# EAGLE design synapse_rpi3_adapter (EAGLE 7.6.0)
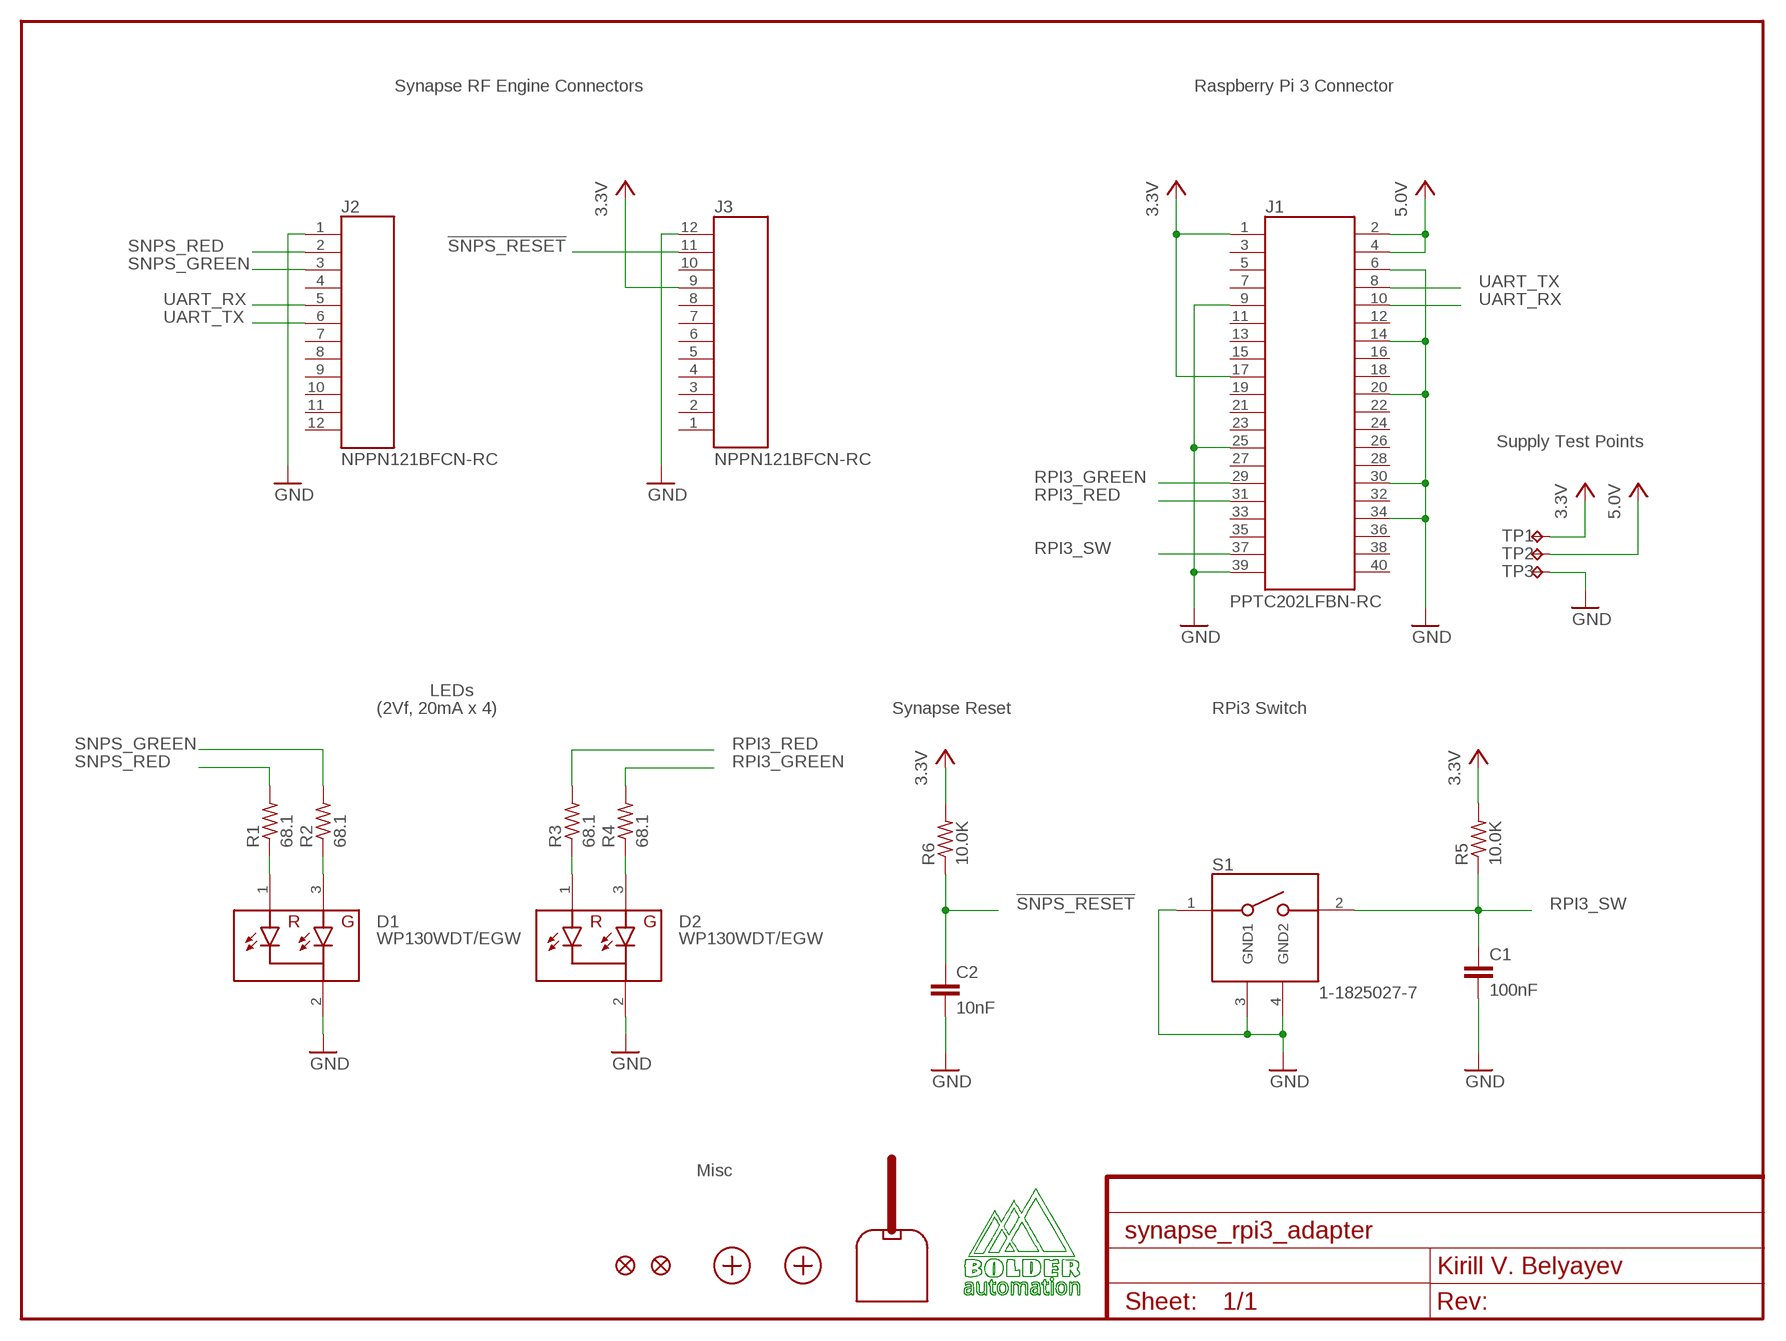
[diagram p0: schematic, sheet 1]
FRAME1 (FRAME-LETTER): CNAME: Synapse RPi3 Adapter; CREVISION: A; DESIGNER: Kirill V. Belyayev

## Parts
C1  100nF  C-EUC0603  [C0603]
C2  10nF  C-EUC0603  [C0603]
D1  WP130WDT/EGW  [WP130WDT/EGW]
D2  WP130WDT/EGW  [WP130WDT/EGW]
FD1  FIDUCIALUFIDUCIAL  [MICRO-FIDUCIAL]
FD2  FIDUCIALUFIDUCIAL  [MICRO-FIDUCIAL]
J1  PPTC202LFBN-RC  [PPTC202LFBN-RC]
J2  NPPN121BFCN-RC  [NPPN121BFCN-RC]
J3  NPPN121BFCN-RC  [NPPN121BFCN-RC]
MNT1  MOUNT-HOLE-NO-PLATE5.0MM  [MOUNT-HOLE-NO-PLATE-5.0MM]
MNT2  MOUNT-HOLE-NO-PLATE5.0MM  [MOUNT-HOLE-NO-PLATE-5.0MM]
R1  68.1  R-US_R0603  [R0603]
R2  68.1  R-US_R0603  [R0603]
R3  68.1  R-US_R0603  [R0603]
R4  68.1  R-US_R0603  [R0603]
R5  10.0K  R-US_R0603  [R0603]
R6  10.0K  R-US_R0603  [R0603]
S1  1-1825027-7  [1-1825027-7]
TP1  TEST-POINT  [TEST-POINT-40MILL]
TP2  TEST-POINT  [TEST-POINT-40MILL]
TP3  TEST-POINT  [TEST-POINT-40MILL]
U$1  BA_LOGO  [BA_LOGO]
X1  RF200PD1  [RF200PD1]

## Nets
0V: C1.2 C2.2 D1.2 D2.2 J1.6 J1.9 J1.14 J1.20 J1.25 J1.30 J1.34 J1.39 J2.1 J3.12 S1.1 S1.3(GND1) S1.4(GND2) TP3.1(PP) ; supply symbol labelled GND
3.3V: J1.1 J1.17 J3.9 R5.2 R6.2 TP1.1(PP)
5.0V: J1.2 J1.4 TP2.1(PP)
!SNPS_RESET: C2.1 J3.11 R6.1
N$1: D1.1(RED) R1.1
N$2: D1.3(GRN) R2.1
N$3: D2.1(RED) R3.1
N$4: D2.3(GRN) R4.1
RPI3_GREEN: J1.29 R4.2
RPI3_RED: J1.31 R3.2
RPI3_SW: C1.1 J1.37 R5.1 S1.2
SNPS_GREEN: J2.3 R2.2
SNPS_RED: J2.2 R1.2
UART_RX: J1.10 J2.5
UART_TX: J1.8 J2.6
Unconnected: J1.3 J1.5 J1.7 J1.11 J1.12 J1.13 J1.15 J1.16 J1.18 J1.19 J1.21 J1.22 J1.23 J1.24 J1.26 J1.27 J1.28 J1.32 J1.33 J1.35 J1.36 J1.38 J1.40 J2.4 J2.7 J2.8 J2.9 J2.10 J2.11 J2.12 J3.1 J3.2 J3.3 J3.4 J3.5 J3.6 J3.7 J3.8 J3.10

## Notes on the sheet
- Synapse RF Engine Connectors | Raspberry Pi 3 Connector
- Supply Test Points
- LEDs
- (2Vf, 20mA x 4) | Synapse Reset | RPi3 Switch
- Misc

## Library data of the parts
C1 C2 = rcl:C-EU: CAPACITOR, European symbol
D1 D2 = KVB-ICs:WP130WDT/EGW: LED Circuit Board Indicator Single Green, Red Diffused, White 2.2V Green, 2V Red 20mA Round with Domed Top 3mm (T-1) Through Hole, Right Angle; MAN-PART_NUM: WP130WDT/EGW; MANUFACTURER: Kingbright
FD1 FD2 = KVB-misc:FIDUCIAL: Fiducial Alignment Points Various fiducial points for machine vision alignment.
J1 = KVB-connectors:PPTC202LFBN-RC: 40 Position Header Connector 0.100" (2.54mm) Through Hole Tin; MAN-PART_NUM: PPTC202LFBN-RC; MANUFACTURER: Sullins Connector Solutions
J2 J3 = KVB-connectors:NPPN121BFCN-RC: 12 Position Header Connector 0.079" (2.00mm) Through Hole Gold; MAN-PART_NUM: NPPN121BFCN-RC; MANUFACTURER: Sullins Connector Solutions
MNT1 MNT2 = KVB-misc:MOUNT-HOLE-NO-PLATE: Various non plated mountain holes
R1-R6 = rcl:R-US_: RESISTOR, American symbol
S1 = KVB-switches:1-1825027-7: Tactile Switch SPST-NO Side Actuated Through Hole Right Angle; MAN-PART_NUM: 1-1825027-7; MANUFACTURER: TE Connectivity
TP1-TP3 = KVB-misc:TEST-POINT: Various Test Points
U$1 = KVB-misc:BA_LOGO: Bolder Automation Logo
X1 = KVB-misc:RF200PD1: Snap Engine RF200PD1; MAN-PART_NUM: RF200PD1; MANUFACTURER: Synapse Wireless

## Board
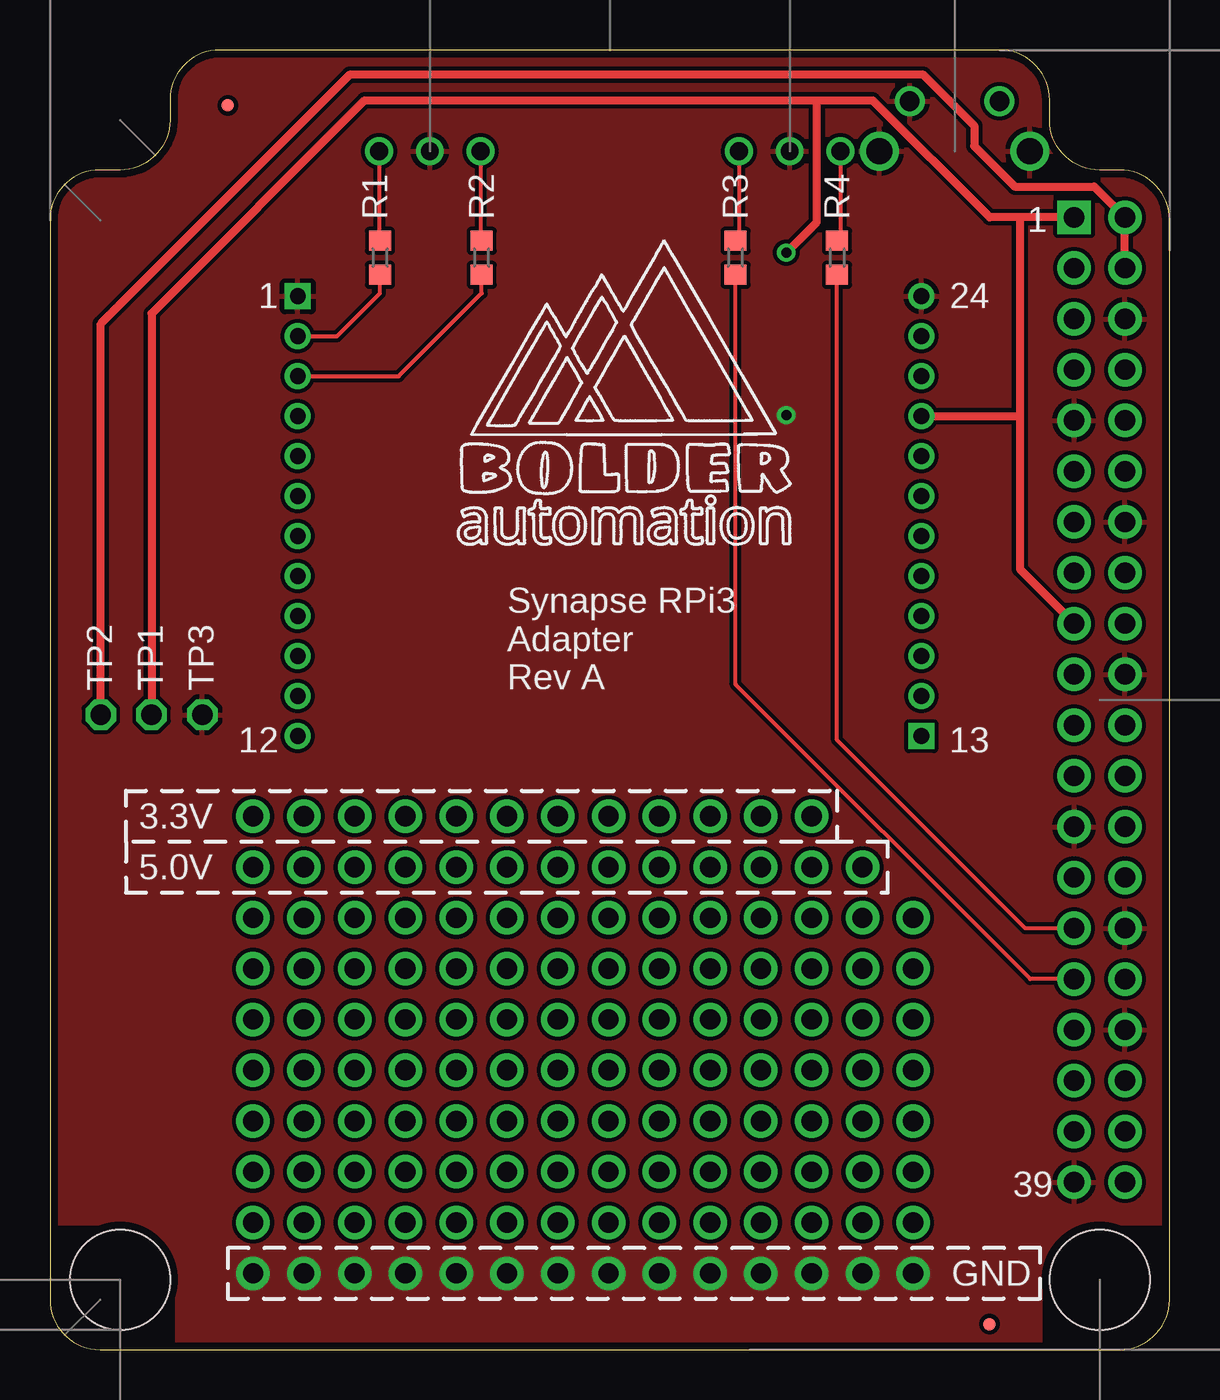
[diagram p1: board, top side]
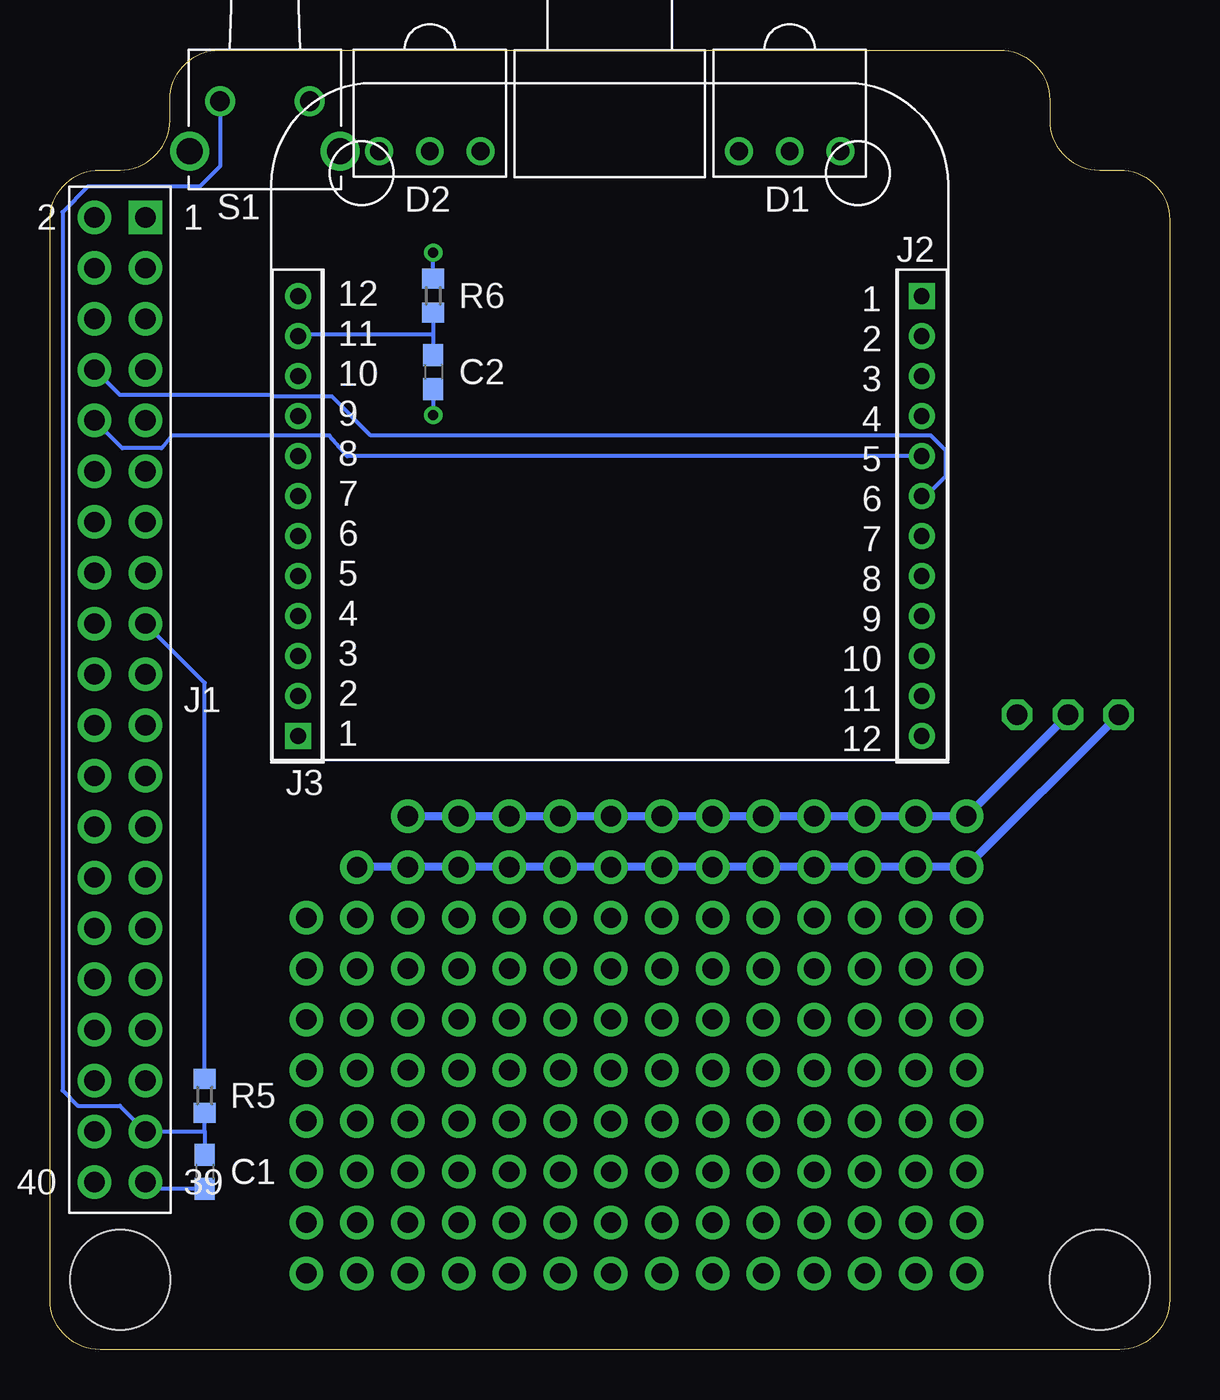
[diagram p2: board, bottom side, seen from below]

Size 56 x 65 mm. Coordinates in mm from the lower left corner, seen from the top.
Outline: 3.5,59 2.5,59 arc90 0,56.5 0,2.5 arc90 2.5,0 53.5,0 arc90 56,2.5 56,56.5 arc90 53.5,59 52.5,59 arc-90 50,61.5 50,62.5 arc90 47.5,65 8.5,65 arc90 6,62.5 6,61.5 arc-90 3.5,59
Copper layers (1*16): Top 0.035mm / dielectric 1.5mm / Bottom 0.035mm
Design rules "KVB-2layer-simple": minimum track width 6mil, minimum drill 15mil, track to track 8mil, track to pad 8mil, pad to pad 8mil, via to via 8mil, smd to smd 8mil, copper to edge 15mil, drill to drill 8mil, minimum pad ring 10mil, minimum via ring 8mil, stop-mask expansion 3mil, vias tented up to drill 0mil, thermal gap 10mil

### Footprints (pad centres in the part's own frame; a part is rotated, then mirrored left to right if it is on the bottom)
C0603 = smd 1.1 x 1: 1 -0.85,0; 2 0.85,0
WP130WDT/EGW = drill 0.889: 1 -2.54,0; 2 0,0; 3 2.54,0
MICRO-FIDUCIAL = smd 0.635 x 0.635: 1 0,0
PPTC202LFBN-RC = drill 1.016 pad 1.676 square: 1 -24.13,1.27 | drill 1.016 pad 1.676: 2 -24.13,-1.27; 3 -21.59,1.27; 4 -21.59,-1.27; 5 -19.05,1.27; 6 -19.05,-1.27; 7 -16.51,1.27; 8 -16.51,-1.27; 9 -13.97,1.27; 10 -13.97,-1.27; 11 -11.43,1.27; 12 -11.43,-1.27; 13 -8.89,1.27; 14 -8.89,-1.27; 15 -6.35,1.27; 16 -6.35,-1.27; 17 -3.81,1.27; 18 -3.81,-1.27; 19 -1.27,1.27; 20 -1.27,-1.27; 21 1.27,1.27; 22 1.27,-1.27; 23 3.81,1.27; 24 3.81,-1.27; 25 6.35,1.27; 26 6.35,-1.27; 27 8.89,1.27; 28 8.89,-1.27; 29 11.43,1.27; 30 11.43,-1.27; 31 13.97,1.27; 32 13.97,-1.27; 33 16.51,1.27; 34 16.51,-1.27; 35 19.05,1.27; 36 19.05,-1.27; 37 21.59,1.27; 38 21.59,-1.27; 39 24.13,1.27; 40 24.13,-1.27
NPPN121BFCN-RC = drill 0.787 square: 1 -11,0 | drill 0.787: 2 -9,0; 3 -7,0; 4 -5,0; 5 -3,0; 6 -1,0; 7 1,0; 8 3,0; 9 5,0; 10 7,0; 11 9,0; 12 11,0
MOUNT-HOLE-NO-PLATE-5.0MM = hole 5: 0,0
R0603 = smd 1 x 1.1: 1 -0.85,0; 2 0.85,0
1-1825027-7 = drill 0.991: 1 -2.248,-2.489; 2 2.248,-2.489 | drill 1.295 pad 1.676: 3 -3.759,0; 4 3.759,0
TEST-POINT-40MILL = drill 1.016 pad 1.524 octagon: 1 0,0

### Placement (x,y rotation side)
C1  48.26,8.89 270 bottom
C2  36.83,48.9 270 bottom
D1  19,59.94 180 bottom
D2  37,59.94 180 bottom
FD1  8.89,62.23 0 top
FD2  46.99,1.27 0 top
J1  52.5,32.5 270 bottom
J2  12.4,41.68 270 bottom
J3  43.59,41.68 90 bottom
MNT1  52.5,3.5 0 top
MNT2  3.5,3.5 0 top
R1  16.51,54.61 270 top
R2  21.59,54.61 270 top
R3  34.29,54.61 270 top
R4  39.37,54.61 270 top
R5  48.26,12.7 90 bottom
R6  36.83,52.7 90 bottom
S1  45.25,59.94 180 bottom
TP1  5.08,31.75 0 top
TP2  2.54,31.75 0 top
TP3  7.62,31.75 0 top
U$1  20.32,39.37 0 top
X1  28,65 0 bottom

### Tracks (layer width: path | path; a pad name or v marks a point on that pad's centre or on a via)
0V  (via drill 0.51, 1.02 pad 1.68)
  Bottom 0.203: C2.2 v36.83,46.74 | C1.2 50.9,8.04 J1.39
  other vias: 10.16,3.81 12.7,3.81 15.24,3.81 17.78,3.81 20.32,3.81 22.86,3.81 25.4,3.81 27.94,3.81 30.48,3.81 33.02,3.81 35.56,3.81 38.1,3.81 40.64,3.81 43.18,3.81
  pour Top: 0,66.04 0,6.35 3.35,6.35 arc-90 6.35,3.35 6.35,0 49.53,0 49.53,3.35 arc-90 52.53,6.35 57.15,6.35 57.15,66.04
3.3V  (via drill 0.51, 1.02 pad 1.68)
  Top 0.406: J1.1 48.51,56.63 | 48.51,56.63 47,56.63 41.15,62.48 38.35,62.48 | TP1.1 5.08,51.82 15.75,62.48 38.35,62.48 | v36.83,54.86 38.35,56.39 38.35,62.48 | J3.9 48.51,46.68 | 48.51,56.63 48.51,46.68 | 48.51,46.68 48.51,39.03 J1.17
  Bottom 0.203: R6.2 v36.83,54.86 | R5.2 48.26,33.34 J1.17
  Bottom 0.406: v38.1,26.67 v35.56,26.67 v33.02,26.67 v30.48,26.67 v27.94,26.67 v25.4,26.67 v22.86,26.67 v20.32,26.67 v17.78,26.67 v15.24,26.67 v12.7,26.67 v10.16,26.67 TP1.1
5.0V  (via drill 1.02 pad 1.68)
  Top 0.406: J1.4 J1.2 52.23,58.17 48.26,58.17 46.23,60.2 46.23,61.21 43.69,63.75 14.99,63.75 2.54,51.31 TP2.1
  Bottom 0.406: TP2.1 v10.16,24.13 v12.7,24.13 v15.24,24.13 v17.78,24.13 v20.32,24.13 v22.86,24.13 v25.4,24.13 v27.94,24.13 v30.48,24.13 v33.02,24.13 v35.56,24.13 v38.1,24.13 v40.64,24.13
!SNPS_RESET
  Bottom 0.203: R6.1 36.83,50.8 | 36.83,50.8 C2.1 | J3.11 43.47,50.8 36.83,50.8
N$1
  Top 0.203: D1.1 16.46,55.51 R1.1
N$2
  Top 0.203: D1.3 21.54,55.51 R2.1
N$3
  Top 0.203: D2.1 34.46,55.63 R3.1
N$4
  Top 0.203: D2.3 39.54,55.63 R4.1
N$21  (via drill 1.02 pad 1.68)
  other vias: 10.16,6.35
N$22  (via drill 1.02 pad 1.68)
  other vias: 12.7,6.35
N$23  (via drill 1.02 pad 1.68)
  other vias: 15.24,6.35
N$24  (via drill 1.02 pad 1.68)
  other vias: 17.78,6.35
N$25  (via drill 1.02 pad 1.68)
  other vias: 20.32,6.35
N$26  (via drill 1.02 pad 1.68)
  other vias: 22.86,6.35
N$27  (via drill 1.02 pad 1.68)
  other vias: 25.4,6.35
N$28  (via drill 1.02 pad 1.68)
  other vias: 27.94,6.35
N$29  (via drill 1.02 pad 1.68)
  other vias: 30.48,6.35
N$30  (via drill 1.02 pad 1.68)
  other vias: 33.02,6.35
N$31  (via drill 1.02 pad 1.68)
  other vias: 35.56,6.35
N$32  (via drill 1.02 pad 1.68)
  other vias: 38.1,6.35
N$33  (via drill 1.02 pad 1.68)
  other vias: 40.64,6.35
N$34  (via drill 1.02 pad 1.68)
  other vias: 43.18,6.35
N$56  (via drill 1.02 pad 1.68)
  other vias: 38.1,21.59
N$57  (via drill 1.02 pad 1.68)
  other vias: 40.64,21.59
N$58  (via drill 1.02 pad 1.68)
  other vias: 43.18,21.59
N$60  (via drill 1.02 pad 1.68)
  other vias: 43.18,19.05
N$61  (via drill 1.02 pad 1.68)
  other vias: 43.18,16.51
N$62  (via drill 1.02 pad 1.68)
  other vias: 43.18,13.97
N$63  (via drill 1.02 pad 1.68)
  other vias: 43.18,11.43
N$64  (via drill 1.02 pad 1.68)
  other vias: 43.18,8.89
N$65  (via drill 1.02 pad 1.68)
  other vias: 10.16,8.89
N$66  (via drill 1.02 pad 1.68)
  other vias: 12.7,8.89
N$67  (via drill 1.02 pad 1.68)
  other vias: 15.24,8.89
N$68  (via drill 1.02 pad 1.68)
  other vias: 17.78,8.89
N$69  (via drill 1.02 pad 1.68)
  other vias: 20.32,8.89
N$70  (via drill 1.02 pad 1.68)
  other vias: 22.86,8.89
N$71  (via drill 1.02 pad 1.68)
  other vias: 25.4,8.89
N$72  (via drill 1.02 pad 1.68)
  other vias: 27.94,8.89
N$73  (via drill 1.02 pad 1.68)
  other vias: 30.48,8.89
N$74  (via drill 1.02 pad 1.68)
  other vias: 33.02,8.89
N$75  (via drill 1.02 pad 1.68)
  other vias: 35.56,8.89
N$76  (via drill 1.02 pad 1.68)
  other vias: 38.1,8.89
N$77  (via drill 1.02 pad 1.68)
  other vias: 40.64,8.89
N$78  (via drill 1.02 pad 1.68)
  other vias: 10.16,11.43
N$79  (via drill 1.02 pad 1.68)
  other vias: 12.7,11.43
N$80  (via drill 1.02 pad 1.68)
  other vias: 15.24,11.43
N$81  (via drill 1.02 pad 1.68)
  other vias: 17.78,11.43
N$82  (via drill 1.02 pad 1.68)
  other vias: 20.32,11.43
N$83  (via drill 1.02 pad 1.68)
  other vias: 22.86,11.43
N$84  (via drill 1.02 pad 1.68)
  other vias: 25.4,11.43
N$85  (via drill 1.02 pad 1.68)
  other vias: 27.94,11.43
N$86  (via drill 1.02 pad 1.68)
  other vias: 30.48,11.43
N$87  (via drill 1.02 pad 1.68)
  other vias: 33.02,11.43
N$88  (via drill 1.02 pad 1.68)
  other vias: 35.56,11.43
N$89  (via drill 1.02 pad 1.68)
  other vias: 38.1,11.43
N$90  (via drill 1.02 pad 1.68)
  other vias: 40.64,11.43
N$91  (via drill 1.02 pad 1.68)
  other vias: 10.16,13.97
N$92  (via drill 1.02 pad 1.68)
  other vias: 12.7,13.97
N$93  (via drill 1.02 pad 1.68)
  other vias: 15.24,13.97
N$94  (via drill 1.02 pad 1.68)
  other vias: 17.78,13.97
N$95  (via drill 1.02 pad 1.68)
  other vias: 20.32,13.97
N$96  (via drill 1.02 pad 1.68)
  other vias: 22.86,13.97
N$97  (via drill 1.02 pad 1.68)
  other vias: 25.4,13.97
N$98  (via drill 1.02 pad 1.68)
  other vias: 27.94,13.97
N$99  (via drill 1.02 pad 1.68)
  other vias: 30.48,13.97
N$100  (via drill 1.02 pad 1.68)
  other vias: 33.02,13.97
N$101  (via drill 1.02 pad 1.68)
  other vias: 35.56,13.97
N$102  (via drill 1.02 pad 1.68)
  other vias: 38.1,13.97
N$103  (via drill 1.02 pad 1.68)
  other vias: 40.64,13.97
N$104  (via drill 1.02 pad 1.68)
  other vias: 10.16,16.51
N$105  (via drill 1.02 pad 1.68)
  other vias: 12.7,16.51
N$106  (via drill 1.02 pad 1.68)
  other vias: 15.24,16.51
N$107  (via drill 1.02 pad 1.68)
  other vias: 17.78,16.51
N$108  (via drill 1.02 pad 1.68)
  other vias: 20.32,16.51
N$109  (via drill 1.02 pad 1.68)
  other vias: 22.86,16.51
N$110  (via drill 1.02 pad 1.68)
  other vias: 25.4,16.51
N$111  (via drill 1.02 pad 1.68)
  other vias: 27.94,16.51
N$112  (via drill 1.02 pad 1.68)
  other vias: 30.48,16.51
N$113  (via drill 1.02 pad 1.68)
  other vias: 33.02,16.51
N$114  (via drill 1.02 pad 1.68)
  other vias: 35.56,16.51
N$115  (via drill 1.02 pad 1.68)
  other vias: 38.1,16.51
N$116  (via drill 1.02 pad 1.68)
  other vias: 40.64,16.51
N$117  (via drill 1.02 pad 1.68)
  other vias: 10.16,19.05
N$118  (via drill 1.02 pad 1.68)
  other vias: 12.7,19.05
N$119  (via drill 1.02 pad 1.68)
  other vias: 15.24,19.05
N$120  (via drill 1.02 pad 1.68)
  other vias: 17.78,19.05
N$121  (via drill 1.02 pad 1.68)
  other vias: 20.32,19.05
N$122  (via drill 1.02 pad 1.68)
  other vias: 22.86,19.05
N$123  (via drill 1.02 pad 1.68)
  other vias: 25.4,19.05
N$124  (via drill 1.02 pad 1.68)
  other vias: 27.94,19.05
N$125  (via drill 1.02 pad 1.68)
  other vias: 30.48,19.05
N$126  (via drill 1.02 pad 1.68)
  other vias: 33.02,19.05
N$127  (via drill 1.02 pad 1.68)
  other vias: 35.56,19.05
N$128  (via drill 1.02 pad 1.68)
  other vias: 38.1,19.05
N$129  (via drill 1.02 pad 1.68)
  other vias: 40.64,19.05
N$130  (via drill 1.02 pad 1.68)
  other vias: 10.16,21.59
N$131  (via drill 1.02 pad 1.68)
  other vias: 12.7,21.59
N$132  (via drill 1.02 pad 1.68)
  other vias: 15.24,21.59
N$133  (via drill 1.02 pad 1.68)
  other vias: 17.78,21.59
N$134  (via drill 1.02 pad 1.68)
  other vias: 20.32,21.59
N$135  (via drill 1.02 pad 1.68)
  other vias: 22.86,21.59
N$136  (via drill 1.02 pad 1.68)
  other vias: 25.4,21.59
N$137  (via drill 1.02 pad 1.68)
  other vias: 27.94,21.59
N$138  (via drill 1.02 pad 1.68)
  other vias: 30.48,21.59
N$139  (via drill 1.02 pad 1.68)
  other vias: 33.02,21.59
N$140  (via drill 1.02 pad 1.68)
  other vias: 35.56,21.59
RPI3_GREEN
  Top 0.203: J1.29 48.78,21.07 39.37,30.48 R4.2
RPI3_RED
  Top 0.203: J1.31 49.03,18.53 34.29,33.27 R3.2
RPI3_SW
  Bottom 0.203: 48.26,10.91 C1.1 | 48.26,10.91 J1.37 52.51,12.19 54.61,12.19 55.37,12.95 55.37,56.9 54.1,58.17 48.51,58.17 47.5,59.18 S1.2 | 48.26,10.91 R5.1
SNPS_GREEN
  Top 0.203: J2.3 17.44,48.68 21.59,52.83 R2.2
SNPS_RED
  Top 0.203: J2.2 14.36,50.68 16.51,52.83 R1.2
UART_RX
  Bottom 0.203: J2.5 41.12,44.68 42.04,45.72 49.91,45.72 50.42,45.09 52.38,45.09 J1.10
UART_TX
  Bottom 0.203: J2.6 12.18,42.68 11.18,43.69 11.18,44.96 11.94,45.72 39.95,45.72 41.91,47.68 44.88,47.68 44.96,47.75 52.51,47.75 J1.8

### Text on the board
tPlace: 1 | 1 | 24 | Synapse RPi3 / Adapter / Rev A | 12 | 13 | 3.3V | 5.0V | 39 | GND